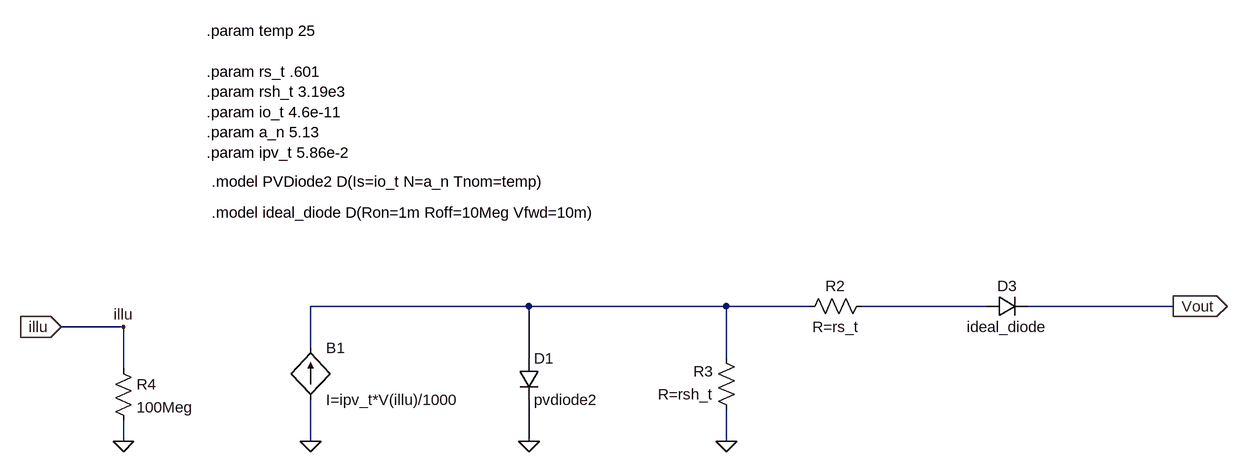
[diagram p0: schematic SM141K04TFS.asc]
SM141K04TFS.asc, the LTspice schematic file:
Version 4
SHEET 1 1228 692
WIRE 64 80 -272 80
WIRE 368 80 64 80
WIRE 496 80 368 80
WIRE 768 80 576 80
WIRE 1056 80 832 80
WIRE -560 112 -656 112
WIRE -272 144 -272 80
WIRE 64 160 64 80
WIRE 368 160 368 80
WIRE -560 176 -560 112
WIRE -560 288 -560 256
WIRE -272 288 -272 224
WIRE 64 288 64 224
WIRE 368 288 368 240
FLAG 368 288 0
FLAG 64 288 0
FLAG -272 288 0
FLAG 1056 80 Vout
IOPIN 1056 80 Out
FLAG -656 112 illu
IOPIN -656 112 In
FLAG -560 112 illu
FLAG -560 288 0
SYMBOL res 592 64 R90
WINDOW 0 0 56 VBottom 2
WINDOW 3 32 56 VTop 2
SYMATTR InstName R2
SYMATTR Value R=rs_t
SYMBOL res 384 256 R180
WINDOW 0 36 76 Left 2
WINDOW 3 36 40 Left 2
SYMATTR InstName R3
SYMATTR Value R=rsh_t
SYMBOL diode 48 160 R0
SYMATTR InstName D1
SYMATTR Value pvdiode2
SYMBOL bi2 -272 144 R0
SYMATTR InstName B1
SYMATTR Value I=ipv_t*V(illu)/1000
SYMBOL diode 768 96 R270
WINDOW 0 32 32 VTop 2
WINDOW 3 0 32 VBottom 2
SYMATTR InstName D3
SYMATTR Value ideal_diode
SYMBOL res -576 160 R0
SYMATTR InstName R4
SYMATTR Value 100Meg
TEXT -424 -112 Left 2 !.model PVDiode2 D(Is=io_t N=a_n Tnom=temp)
TEXT -432 -344 Left 2 !.param temp 25\n \n.param rs_t .601\n.param rsh_t 3.19e3\n.param io_t 4.6e-11\n.param a_n 5.13\n.param ipv_t 5.86e-2
TEXT -424 -64 Left 2 !.model ideal_diode D(Ron=1m Roff=10Meg Vfwd=10m)

The netlist it stands for:
* SM141K04TFS.asc
R2 N002 N001 R=rs_t
R3 0 N001 R=rsh_t
D1 N001 0 pvdiode2
B1 0 N001 I=ipv_t*V(illu)/1000
D3 N002 Vout ideal_diode
R4 illu 0 100Meg
.model D D
.lib standard.dio
.model PVDiode2 D(Is=io_t N=a_n Tnom=temp)
.param temp 25
.param rs_t .601
.param rsh_t 3.19e3
.param io_t 4.6e-11
.param a_n 5.13
.param ipv_t 5.86e-2
.model ideal_diode D(Ron=1m Roff=10Meg Vfwd=10m)
.backanno
.end